# Altium project PCB_Project.PrjPcb (part 2 of 3)

## Sheet OutputChannel.SchDoc
size A4
Used 8 times, as channels U_OutputChannel1, U_OutputChannel2, U_OutputChannel3, U_OutputChannel4, U_OutputChannel5, U_OutputChannel6, U_OutputChannel7, U_OutputChannel8. Parts and nets are listed once, with the designators drawn on the sheet.
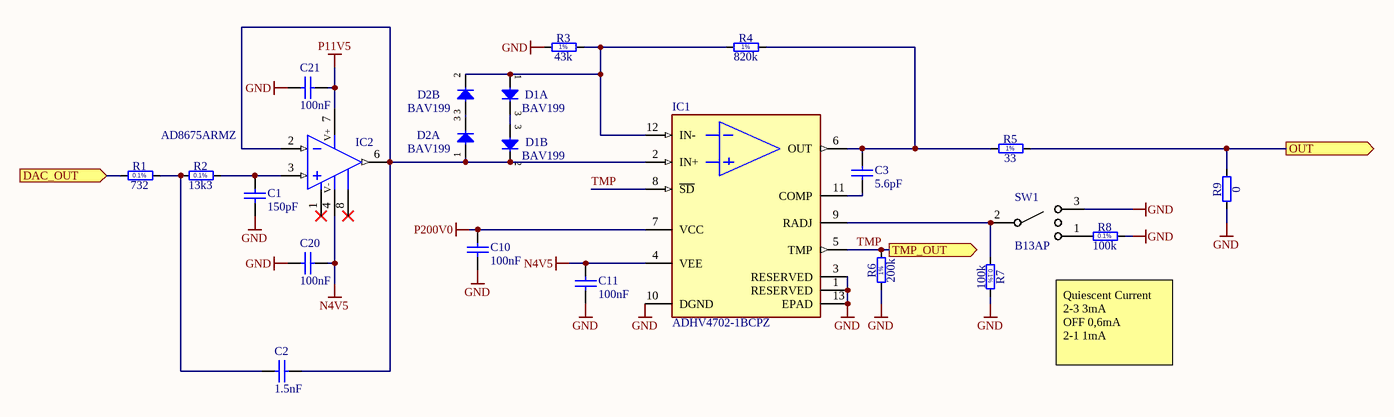
[diagram p4: OutputChannel.SchDoc]

### Parts
C1  150pF  [C0402C151K4RACTU]
C2  1.5nF  [C0402C152K3RACTU]
C3  5.6pF  [CBR08C569CAGAC]
C10  100nF  [C2012X7T2E104K125AA]
C11  100nF  [C0402C104K4RACTU]
C20  100nF  [C0402C104K4RACTU]
C21  100nF  [C0402C104K4RACTU]
D1  BAV199  [SOT95P240X110-3N]  (parts A,B of 2)
D2  BAV199  [SOT95P240X110-3N]  (parts A,B of 2)
IC1  ADHV4702-1BCPZ  [FP-ADHV4702-1BCPZ-IPC_B]
IC2  AD8675ARMZ  [SOP65P490X110-8N]
R1  732  [RESC1608X55N]
R2  13k3  [RESC1608X55N]
R3  43k  [RESC1608X55N]
R4  820k  [RESC1608X55N]
R5  33  [RESC1608X55N]
R6  200k  [RESC1608X55N]
R7  100k  [RESC1608X55N]
R8  100k  [RESC1608X55N]
R9  0  [RESC1608X55N]
SW1  B13AP  [B13AP]

### Ports
DAC_OUT (in), OUT (out), TMP_OUT (out)

### Nets
GND: C1.1 C10.1 C11.1 C20.2 C21.2 IC1.1(RESERVED) IC1.3(RESERVED) IC1.10(DGND) IC1.13(EPAD) R3.1 R6.1 R7.2 R8.2 R9.1 SW1.3(NC)
N4V5: C11.2 C20.1 IC1.4(VEE) IC2.4(V-)
P11V5: C21.1 IC2.7(V+)
P200V0: C10.2 IC1.7(VCC)
DAC_OUT: R1.1 ; port DAC_OUT
OUT: R5.2 R9.2 ; port OUT
TMP: IC1.5(TMP) IC1.8(~{SD}) R6.2 ; port TMP_OUT
NetC1_2: C1.2 IC2.3(IN+) R2.2
NetC2_1: C2.1 R1.2 R2.1
NetC2_2: C2.2 D1.2(C) D2.1(A) IC1.2(IN+) IC2.2(IN-) IC2.6(OUT)
NetC3_1: C3.1 IC1.11(COMP)
NetC3_2: C3.2 IC1.6(OUT) R4.2 R5.1
NetD1_1: D1.1(A) D2.2(C) IC1.12(IN-) R3.2 R4.1
NetIC1_9: IC1.9(RADJ) R7.1 SW1.2(C)
NetR8_1: R8.1 SW1.1(NO)

Not connected (* = marked no-connect by the designer): D1 3(COMAC); D2 3(COMAC); IC2 1(OFFSET)* 8(OFFSET)*

### Channels
U_OutputChannel1: designators end in _U_OutputChannel1; ports DAC_OUT=VOUT1 OUT=Channel_OUT1 TMP_OUT=Channel_TMP1
U_OutputChannel2: designators end in _U_OutputChannel2; ports DAC_OUT=VOUT2 OUT=Channel_OUT2 TMP_OUT=Channel_TMP2
U_OutputChannel3: designators end in _U_OutputChannel3; ports DAC_OUT=VOUT3 OUT=Channel_OUT3 TMP_OUT=Channel_TMP3
U_OutputChannel4: designators end in _U_OutputChannel4; ports DAC_OUT=VOUT4 OUT=Channel_OUT4 TMP_OUT=Channel_TMP4
U_OutputChannel5: designators end in _U_OutputChannel5; ports DAC_OUT=VOUT5 OUT=Channel_OUT5 TMP_OUT=Channel_TMP5
U_OutputChannel6: designators end in _U_OutputChannel6; ports DAC_OUT=VOUT6 OUT=Channel_OUT6 TMP_OUT=Channel_TMP6
U_OutputChannel7: designators end in _U_OutputChannel7; ports DAC_OUT=VOUT7 OUT=Channel_OUT7 TMP_OUT=Channel_TMP7
U_OutputChannel8: designators end in _U_OutputChannel8; ports DAC_OUT=VOUT8 OUT=Channel_OUT8 TMP_OUT=Channel_TMP8

### Notes on the sheet
- Quiescent Current   2-3 3mA               OFF 0,6mA          2-1 1mA
- (in symbol R0603_13K3_0.1%_0.063W_10PPM) 0.1%
- (in symbol R0603_33R_1%_0.1W_100PPM) 1%
- (in symbol R0603_43K_1%_0.1W_100PPM) 1%
- (in symbol R0603_100K_0.1%_0.063W_10PPM) 0.1%
- (in symbol R0603_200K_1%_0.1W_100PPM) 1%
- (in symbol R0603_732R_0.1%_0.063W_10PPM) 0.1%
- (in symbol R0603_820K_1%_0.1W_100PPM) 1%

### Library data of the parts
C1 = C0402C151K4RACTU: CAP CER 150PF 16V X7R 0402; Manufacturer 1: KEMET; Dielectric Material: Ceramic; Tolerance: 10%; Dissipation Factor: 3.5%; Supplier 1: Mouser; Manufacturer Part Number 1: C0402C151K4RACTU; Stock 1: 30613; Pricing 1: 1=0,40000, 10=0,24600, 100=0,14800, 500=0,12700, 1000=0,10900, 2000=0,08700 (USD); RoHS: Yes; Mount: Surface Mount; Case/Package: 0402; Case Code (Imperial): 0402; Case Code (Metric): 1005; Min Operating Temperature: -55°C; Max Operating Temperature: 125°C; Capacitance: 150pF; Packaging: Tape and Reel; Voltage Rating (DC): 16V; Dielectric: X7R; Package Quantity: 10000; Voltage Rating: 16V; Termination: SMD/SMT; Length: 1mm; Height: 0.5mm; Depth: 0.5mm; Width: 0.5mm; Lead Pitch: 0.3mm; Thickness: 0.022inch; ComponentLink1URL: http://www.mouser.com/ds/2/212/KEM_C1002_X7R_SMD-1102033.pdf?src-supplier=Mouser; ComponentLink1Description: http://www.mouser.com/ds/2/212/KEM_C1002_X7R_SMD-1102033.pdf?src-supplier=Mouser; ComponentLink2URL: http://components.arrow.com/part/dataview/3441836S7752286N7429?src-supplier=Arrow; ComponentLink2Description: http://components.arrow.com/part/dataview/3441836S7752286N7429?src-supplier=Arrow; ComponentLink3URL: http://www.kemet.com/docfinder?Partnumber=C0402C151K4RACTU&src-supplier=Digi-Key; ComponentLink3Description: http://www.kemet.com/docfinder?Partnumber=C0402C151K4RACTU&src-supplier=Digi-Key; Supplier Part Number 1: 80-C0402C151K4R
C2 = C0402C152K3RACTU: CAP CER 1,5nF 25V X7R 10% SMD 0402 125°C Paper T/R; Manufacturer 1: KEMET; Dielectric Material: Ceramic; Dissipation Factor: 3.5%; Supplier 1: Digi-Key; Manufacturer Part Number 1: C0402C152K3RACTU; Stock 1: 25060; Pricing 1: 1=0,13000, 10=0,09300, 50=0,05280, 100=0,04370, 500=0,03064, 1000=0,02536, 2500=0,02360, 5000=0,02159 (USD); RoHS: Yes; Mount: Surface Mount; Case/Package: 0402; Case Code (Metric): 1005; Case Code (Imperial): 0402; Min Operating Temperature: -55°C; Max Operating Temperature: 125°C; Capacitance: 1.5nF; Tolerance: 10%; Packaging: Tape and Reel; Voltage Rating (DC): 25V; Dielectric: X7R; Voltage Rating: 25V; Package Quantity: 1; Termination: SMD/SMT; Length: 1mm; Height: 0.5mm; Depth: 0.5mm; Width: 0.02inch; Thickness: 0.022inch; Lead Pitch: 0.3mm; ComponentLink1URL: http://www.mouser.com/ds/2/212/KEM_C1002_X7R_SMD-1102033.pdf?src-supplier=Mouser; ComponentLink1Description: http://www.mouser.com/ds/2/212/KEM_C1002_X7R_SMD-1102033.pdf?src-supplier=Mouser; ComponentLink2URL: http://www.farnell.com/datasheets/2749581.pdf?src-supplier=Farnell; ComponentLink2Description: http://www.farnell.com/datasheets/2749581.pdf?src-supplier=Farnell; ComponentLink3URL: http://components.arrow.com/part/dataview/2084902S4186842N7429?src-supplier=Arrow; ComponentLink3Description: http://components.arrow.com/part/dataview/2084902S4186842N7429?src-supplier=Arrow; ComponentLink4URL: http://www.farnell.com/datasheets/2749581.pdf?src-supplier=Newark; ComponentLink4Description: http://www.farnell.com/datasheets/2749581.pdf?src-supplier=Newark; ComponentLink5URL: https://search.kemet.com/component-edge/download/datasheet/C0402C152K3RACTU.pdf?src-supplier=Digi-Key; ComponentLink5Description: https://search.kemet.com/component-edge/download/datasheet/C0402C152K3RACTU.pdf?src-supplier=Digi-Key; ComponentLink6URL: https://api.kemet.com/component-edge/download/datasheet/C0402C152K3RACTU.pdf?src-supplier=Digi-Key; ComponentLink6Description: https://api.kemet.com/component-edge/download/datasheet/C0402C152K3RACTU.pdf?src-supplier=Digi-Key; Supplier Part Number 1: 399-8951-1-ND
C3 = CBR08C569CAGAC: CAP CER 5.6PF 250V C0G/NP0 0805; Manufacturer 1: KEMET; Dielectric: C0G; Supplier 1: Mouser; Manufacturer Part Number 1: CBR08C569CAGAC; Stock 1: 9135; Pricing 1: 1=1,05000, 10=0,74500, 100=0,47000, 500=0,42300, 1000=0,38500, 4000=0,31800 (USD); RoHS: Yes; Mount: Surface Mount; Case/Package: 0805; Weight: 0.000194oz; Case Code (Metric): 2012; Case Code (Imperial): 0805; Min Operating Temperature: -55°C; Max Operating Temperature: 125°C; Packaging: Tape and Reel; Package Quantity: 1; Capacitance: 5.6pF; Voltage Rating: 250V; Voltage Rating (DC): 250V; Termination: SMD/SMT; Length: 0.079inch; Height: 0.85mm; Width: 0.049inch; Thickness: 0.035inch; ComponentLink1URL: https://datasheet.ciiva.com/6258/kem-c1030-cbr-smd-6258011.pdf?src-supplier=Digi-Key; ComponentLink1Description: https://datasheet.ciiva.com/6258/kem-c1030-cbr-smd-6258011.pdf?src-supplier=Digi-Key; ComponentLink2URL: https://datasheet.ciiva.com/6258/kem-c1030-cbr-smd-6258013.pdf?src-supplier=Digi-Key; ComponentLink2Description: https://datasheet.ciiva.com/6258/kem-c1030-cbr-smd-6258013.pdf?src-supplier=Digi-Key; ComponentLink3URL: https://datasheet.ciiva.com/6258/kem-c1030-cbr-smd-6258015.pdf?src-supplier=Digi-Key; ComponentLink3Description: https://datasheet.ciiva.com/6258/kem-c1030-cbr-smd-6258015.pdf?src-supplier=Digi-Key; Supplier Part Number 1: 80-CBR08C569CAG
C10 = C2012X7T2E104K125AA: TDK         C2012X7T2E104K125AA             SMD Multilayer Ceramic Capacitor, 0805 [2012 Metric], 0.1 F, 250 V,  10%, X7T, C Series                          New; Voltage Rating (DC): 250V; Supplier 1: Digi-Key; Manufacturer 1: TDK; Manufacturer Part Number 1: C2012X7T2E104K125AA; Stock 1: 145107; Pricing 1: 1=0,32000, 10=0,21800, 50=0,14520, 100=0,12340, 500=0,08712, 1000=0,07623 (USD); RoHS: Yes; Mount: Surface Mount; Case/Package: 0805; Case Code (Imperial): 0805; Case Code (Metric): 2012; Min Operating Temperature: -55°C; Max Operating Temperature: 125°C; Dielectric: X7T; Capacitance: 100nF; Tolerance: 10%; Package Quantity: 1; Voltage Rating: 250V; Packaging: Tape and Reel; Length: 2mm; Height: 1.25mm; Thickness: 0.057inch; Depth: 1.25mm; Width: 0.049inch; Radiation Hardening: No; Lead Free: Lead Free; REACH SVHC: No SVHC; ComponentLink1URL: http://components.arrow.com/part/dataview/0323_06886774?src-supplier=Arrow+Europe; ComponentLink1Description: http://components.arrow.com/part/dataview/0323_06886774?src-supplier=Arrow+Europe; ComponentLink2URL: https://product.tdk.com/info/en/catalog/datasheets/mlcc_commercial_midvoltage_en.pdf?src-supplier=Digi-Key; ComponentLink2Description: https://product.tdk.com/info/en/catalog/datasheets/mlcc_commercial_midvoltage_en.pdf?src-supplier=Digi-Key; ComponentLink3URL: http://components.arrow.com/part/dataview/57434366S459809N1165?src-supplier=Arrow; ComponentLink3Description: http://components.arrow.com/part/dataview/57434366S459809N1165?src-supplier=Arrow; ComponentLink4URL: http://product.tdk.com/capacitor/mlcc/en/documents/mlcc_commercial_midvoltage_en.pdf?src-supplier=Avnet; ComponentLink4Description: http://product.tdk.com/capacitor/mlcc/en/documents/mlcc_commercial_midvoltage_en.pdf?src-supplier=Avnet; ComponentLink5URL: http://product.tdk.com/capacitor/mlcc/en/documents/mlcc_commercial_midvoltage_en.pdf?src-supplier=Avnet+Europe; ComponentLink5Description: http://product.tdk.com/capacitor/mlcc/en/documents/mlcc_commercial_midvoltage_en.pdf?src-supplier=Avnet+Europe; ComponentLink6URL: http://www.farnell.com/datasheets/1913358.pdf?src-supplier=Element14; ComponentLink6Description: http://www.farnell.com/datasheets/1913358.pdf?src-supplier=Element14; ComponentLink7URL: https://product.tdk.com/info/en/catalog/spec/mlccspec_commercial_general_midvoltage_en.pdf?src-supplier=Digi-Key; ComponentLink7Description: https://product.tdk.com/info/en/catalog/spec/mlccspec_commercial_general_midvoltage_en.pdf?src-supplier=Digi-Key; ComponentLink8URL: http://www.farnell.com/datasheets/1913358.pdf?src-supplier=Newark; ComponentLink8Description: http://www.farnell.com/datasheets/1913358.pdf?src-supplier=Newark; Supplier Part Number 1: 445-C2012X7T2E104K125AACT-ND
C11 C20 C21 = C0402C104K4RACTU: Capacitor; Ceramic; Cap; .100uF; Tol 10%; SMT; Vol-Rtg 16V; X7R; Tape and Reel; Manufacturer 1: KEMET; Dissipation Factor: 3.5%; Supplier 1: Digi-Key; Manufacturer Part Number 1: C0402C104K4RACTU; Stock 1: 636137; Pricing 1: 1=0,10000, 10=0,04000, 50=0,02180, 100=0,01780, 500=0,01270, 1000=0,00998, 2500=0,00908, 5000=0,00835 (USD); RoHS: Yes; Mount: Surface Mount; Case/Package: 0402; Case Code (Imperial): 0402; Case Code (Metric): 1005; Contact Plating: Tin,Matte; Min Operating Temperature: -55°C; Max Operating Temperature: 125°C; Capacitance: 100nF; Tolerance: 10%; Packaging: Tape and Reel; Voltage Rating (DC): 16V; Dielectric: X7R; Package Quantity: 10000; Voltage Rating: 16V; Termination: SMD/SMT; Length: 1mm; Height: 0.5mm; Width: 0.5mm; Depth: 0.5mm; Radiation Hardening: No; ComponentLink1URL: https://datasheet.ciiva.com/45846/docfinderpartnumberc0402c102k5ractu-45846919.pdf?src-supplier=Onlinecomponents.com; ComponentLink1Description: https://datasheet.ciiva.com/45846/docfinderpartnumberc0402c102k5ractu-45846919.pdf?src-supplier=Onlinecomponents.com; ComponentLink2URL: https://datasheet.ciiva.com/18192/getdatasheetpartid-385384-18192412.pdf?src-supplier=Verical; ComponentLink2Description: https://datasheet.ciiva.com/18192/getdatasheetpartid-385384-18192412.pdf?src-supplier=Verical; Supplier Part Number 1: 399-3521-1-ND
D1 D2 = BAV199: Serial Diode; Part Description: Low-Leakage Double Diode; Manufacturer: NXP SEMICONDUCTORS; Voltage: 75V; Power: 250mW; PressFit: No; Bonding: No; Part Number: BAV199; Component Kind: Standard; Component Type: Standard; Device: BAV199; PackageDescription: SOT23 3-Leads, Pitch 0.95mm - Body 1.4x3mm, IPC Medium Density; Manufacturer Part Number: BAV199; Pin Count: 3; Case: SOT23-3; Mounted: Yes; Socket: No; SMD: Yes; Sense: No; ComponentHeight: 1.1mm; HelpURL: \\cern.ch\dfs\Applications\Altium\Datasheets\BAV199.pdf; Author: CERN DEM JMW; CreateDate: 21.11.2008; LatestRevisionDate: 21.11.2008
IC1 = ADHV4702-1BCPZ: IC OPAMP GP 1 CIRCUIT 12LFCSP; Manufacturer: Analog Devices; Max Supply Voltage: 220V; Standoff Height: 0.02mm; Input Offset Voltage: 0.15mV; Output Current Per Channel: 20mA; Number Of Channels: 1; Max Junction Temp: +150°C; Min Supply Voltage: 24V; Response Time: 13us; Input Bias Current: 0.0000003uA; Voltage Gain: 170dB; Max Dual Supply Voltage: 110V; Nominal Supply Current: 0.6-3mA; Min Dual Supply Voltage: 12V; Gain Bandwidth: 10MHz; Temperature: -40°C to +85°C; Height: 0.8mm; Device Class L2: Linear ICs; Digikey Description: IC OPAMP GP 1 CIRCUIT 12LFCSP; Lead Free: Yes; Device Class L1: Integrated Circuits (ICs); RoHS: TRUE; ComponentLink2Description: Datasheet; Ipc Land Pattern Name: QFN170P700X700X75-12; Manufacturer Part Number: ADHV4702-1BCPZ; ComponentLink2URL: https://www.analog.com/media/en/technical-documentation/data-sheets/ADHV4702-1.pdf; Octopart: https://octopart.com/adhv4702-1bcpz-analog+devices-95933827; Package: LFCSP12; Automotive: No; Temperature Range Low: -40°C; Device Class L3: Amplifiers - Op Amps; Category: IC; Temperature Range High: +85°C
IC2 = AD8675ARMZ: Operational Amplifier with Offset 1-8; Part Description: 36V Precision, 2.8nV/sqrt Hz Rail-to-Rail Output Operational Amplifier; Manufacturer: ANALOG DEVICES; PressFit: No; Bonding: No; Part Number: AD8675ARMZ; Component Kind: Standard; Component Type: Standard; Device: AD8675ARMZ; PackageDescription: SOP, 0.65mm pitch; 8 pin, 3.00mm W X 3.00mm L X 1.10mm H body, IPC Medium Density; Manufacturer Part Number: AD8675ARMZ; Pin Count: 8; Case: MSOP8; Mounted: Yes; Socket: No; SMD: Yes; Sense: No; ComponentHeight: 1.1mm; Author: CERN DEM JMW; HelpURL: \\cern.ch\dfs\Applications\Altium\Datasheets\AD8675ARMZ.pdf; CreateDate: 06.09.2011; LatestRevisionDate: 06.09.2011
R1 = R0603_732R_0.1%_0.063W_10PPM: Resistor - 0.1%; Part Description: Thin Film Chip Resistor; Manufacturer: GENERIC; Manufacturer1 Part Number: RN73C1J732RBTDF; Power: 0.063W; TC: ±10ppm; PressFit: No; Part Number: R0603_732R_0.1%_0.063W_10PPM; Component Kind: Standard; Component Type: Standard; Pin Count: 2; Value: 732; Status: Not Recommended; Tolerance: ±0.1%; Manufacturer Part Number: R0603_732R_0.1%_0.063W_10PPM; Case: 0603; Mounted: Yes; Sense: No; Socket: No; SMD: Yes; Manufacturer1 Example: TYCO HOLSWORTHY; Manufacturer1 ComponentHeight: 0.5mm; HelpURL: \\cern.ch\dfs\Applications\Altium\Datasheets\R0603_Tyco_RN73.pdf; Author: CERN DEM JLC; CreateDate: 03.12.2007; LatestRevisionDate: 13.03.2008
R2 = R0603_13K3_0.1%_0.063W_10PPM: Resistor - 0.1%; Part Description: Thin Film Chip Resistor; Manufacturer: GENERIC; Manufacturer1 Part Number: RN73C1J13K3BTDF; Power: 0.063W; TC: ±10ppm; PressFit: No; Part Number: R0603_13K3_0.1%_0.063W_10PPM; Component Kind: Standard; Component Type: Standard; Pin Count: 2; Value: 13k3; Status: Not Recommended; Tolerance: ±0.1%; Manufacturer Part Number: R0603_13K3_0.1%_0.063W_10PPM; Case: 0603; Mounted: Yes; Sense: No; Socket: No; SMD: Yes; Manufacturer1 Example: TYCO HOLSWORTHY; Manufacturer1 ComponentHeight: 0.5mm; HelpURL: \\cern.ch\dfs\Applications\Altium\Datasheets\R0603_Tyco_RN73.pdf; Author: CERN DEM JLC; CreateDate: 03.12.2007; LatestRevisionDate: 13.03.2008
R3 = R0603_43K_1%_0.1W_100PPM: Resistor - 1%; Part Description: General Purpose Thick Film Chip Resistor; Manufacturer: GENERIC; Manufacturer1 Part Number: NRC06F4302TRF; Power: 0.1W; TC: ±100ppm/°C; PressFit: No; Part Number: R0603_43K_1%_0.1W_100PPM; Component Kind: Standard; Component Type: Standard; Pin Count: 2; Value: 43k; Status: Preferred; Tolerance: ±1%; Manufacturer Part Number: R0603_43K_1%_0.1W_100PPM; Case: 0603; Mounted: Yes; Sense: No; Socket: No; SMD: Yes; Manufacturer1 Example: NIC COMPONENT; Manufacturer1 ComponentHeight: 0.55mm; HelpURL: \\cern.ch\dfs\Applications\Altium\Datasheets\R0603_NIC_NRC.pdf; Author: CERN DEM JLC; CreateDate: 03.12.2007; LatestRevisionDate: 13.03.2008
R4 = R0603_820K_1%_0.1W_100PPM: Resistor - 1%; Part Description: General Purpose Thick Film Chip Resistor; Manufacturer: GENERIC; Manufacturer1 Part Number: NRC06F8203TRF; Power: 0.1W; TC: ±100ppm/°C; PressFit: No; Part Number: R0603_820K_1%_0.1W_100PPM; Component Kind: Standard; Component Type: Standard; Pin Count: 2; Value: 820k; Status: Preferred; Tolerance: ±1%; Manufacturer Part Number: R0603_820K_1%_0.1W_100PPM; Case: 0603; Mounted: Yes; Sense: No; Socket: No; SMD: Yes; Manufacturer1 Example: NIC COMPONENT; Manufacturer1 ComponentHeight: 0.55mm; HelpURL: \\cern.ch\dfs\Applications\Altium\Datasheets\R0603_NIC_NRC.pdf; Author: CERN DEM JLC; CreateDate: 03.12.2007; LatestRevisionDate: 13.03.2008
R5 = R0603_33R_1%_0.1W_100PPM: Resistor - 1%; Part Description: General Purpose Thick Film Chip Resistor; Manufacturer: GENERIC; Manufacturer1 Part Number: NRC06F33R0TRF; Power: 0.1W; TC: ±100ppm/°C; PressFit: No; Part Number: R0603_33R_1%_0.1W_100PPM; Component Kind: Standard; Component Type: Standard; Pin Count: 2; Value: 33; Status: Preferred; Tolerance: ±1%; Manufacturer Part Number: R0603_33R_1%_0.1W_100PPM; Case: 0603; Mounted: Yes; Sense: No; Socket: No; SMD: Yes; Manufacturer1 Example: NIC COMPONENT; Manufacturer1 ComponentHeight: 0.55mm; HelpURL: \\cern.ch\dfs\Applications\Altium\Datasheets\R0603_NIC_NRC.pdf; Author: CERN DEM JLC; CreateDate: 03.12.2007; LatestRevisionDate: 13.03.2008
R6 = R0603_200K_1%_0.1W_100PPM: Resistor - 1%; Part Description: General Purpose Thick Film Chip Resistor; Manufacturer: GENERIC; Manufacturer1 Part Number: NRC06F2003TRF; Power: 0.1W; TC: ±100ppm/°C; PressFit: No; Part Number: R0603_200K_1%_0.1W_100PPM; Component Kind: Standard; Component Type: Standard; Pin Count: 2; Value: 200k; Status: Preferred; Tolerance: ±1%; Manufacturer Part Number: R0603_200K_1%_0.1W_100PPM; Case: 0603; Mounted: Yes; Sense: No; Socket: No; SMD: Yes; Manufacturer1 Example: NIC COMPONENT; Manufacturer1 ComponentHeight: 0.55mm; HelpURL: \\cern.ch\dfs\Applications\Altium\Datasheets\R0603_NIC_NRC.pdf; Author: CERN DEM JLC; CreateDate: 03.12.2007; LatestRevisionDate: 13.03.2008
R7 R8 = R0603_100K_0.1%_0.063W_10PPM: Resistor - 0.1%; Part Description: Thin Film Chip Resistor; Manufacturer: GENERIC; Manufacturer1 Part Number: RN73C1J100KBTDF; Power: 0.063W; TC: ±10ppm; PressFit: No; Part Number: R0603_100K_0.1%_0.063W_10PPM; Component Kind: Standard; Component Type: Standard; Pin Count: 2; Value: 100k; Status: Not Recommended; Tolerance: ±0.1%; Manufacturer Part Number: R0603_100K_0.1%_0.063W_10PPM; Case: 0603; Mounted: Yes; Sense: No; Socket: No; SMD: Yes; Manufacturer1 Example: TYCO HOLSWORTHY; Manufacturer1 ComponentHeight: 0.55mm; HelpURL: \\cern.ch\dfs\Applications\Altium\Datasheets\R0603_Tyco_RN73.pdf; Author: CERN DEM JLC; CreateDate: 03.12.2007; LatestRevisionDate: 13.03.2008
R9 = R0603_0R_JUMPER: Resistor; Part Description: 1A (0.05R Max DC Resistance) Zero Ohm Jumper; Manufacturer: GENERIC; Manufacturer1 Part Number: NRC06Z0; PressFit: No; Part Number: R0603_0R_JUMPER; Component Kind: Standard; Component Type: Standard; Pin Count: 2; Value: 0; Status: Preferred; Manufacturer Part Number: R0603_0R_JUMPER; Case: 0603; Mounted: Yes; Sense: No; Socket: No; SMD: Yes; Manufacturer1 Example: NIC COMPONENT; Manufacturer1 ComponentHeight: 0.55mm; HelpURL: \\cern.ch\dfs\Applications\Altium\Datasheets\R0603_NIC_NRC.pdf; Author: CERN DEM JLC; CreateDate: 03.12.2007; LatestRevisionDate: 13.03.2008
SW1 = B13AP: Switch;  Sealed;  Anti-Static Toggle;  SPDT;  ON-OFF-ON;  Str PC;  No Cap;  0.4A;  28VAC/DC; Manufacturer 1: NKK Switches; Actuator Material: Brass; Voltage Rating (AC): 28V; Current Rating: 100mA; Power Rating: 400mW; Illumination Type: Non-Illuminated,Illuminated; Electrical Life: 50000Cycles; Actuator Type: Standard Round; Actuator Length: 10mm; Supplier 1: Digi-Key; Manufacturer Part Number 1: B13AP; Stock 1: 542; Pricing 1: 1=3,70000, 10=3,31100, 25=3,14160, 50=2,98760, 100=2,84900, 250=2,72580, 500=2,49480, 1000=2,37160 (USD); RoHS: Yes; Mount: Through Hole,PCB; Number of Pins: 1; Contact Plating: Gold; Contact Material: Bronze,Gold; Min Operating Temperature: -30°C; Max Operating Temperature: 85°C; Throw Configuration: SPDT; Packaging: Bulk; Voltage Rating (DC): 28V; Orientation: Vertical; Package Quantity: 1; Switch Function: On-Off-On; Termination: Solder; Max Current Rating: 100mA; Max Voltage Rating (AC): 28V; Max Voltage Rating (DC): 28V; Contact Current Rating: 100mA; Length: 8.8mm; Depth: 6.8mm; Lead Free: Lead Free; REACH SVHC: No SVHC; ComponentLink1URL: https://datasheet.ciiva.com/5287/btoggles-28447-5287190.pdf?src-supplier=Mouser; ComponentLink1Description: https://datasheet.ciiva.com/5287/btoggles-28447-5287190.pdf?src-supplier=Mouser; ComponentLink2URL: https://datasheet.ciiva.com/14542/70192333-14542216.pdf?src-supplier=Allied+Electronics; ComponentLink2Description: https://datasheet.ciiva.com/14542/70192333-14542216.pdf?src-supplier=Allied+Electronics; Supplier Part Number 1: 360-1013-ND